# EAGLE design cpu_board (EAGLE 7.2.0)
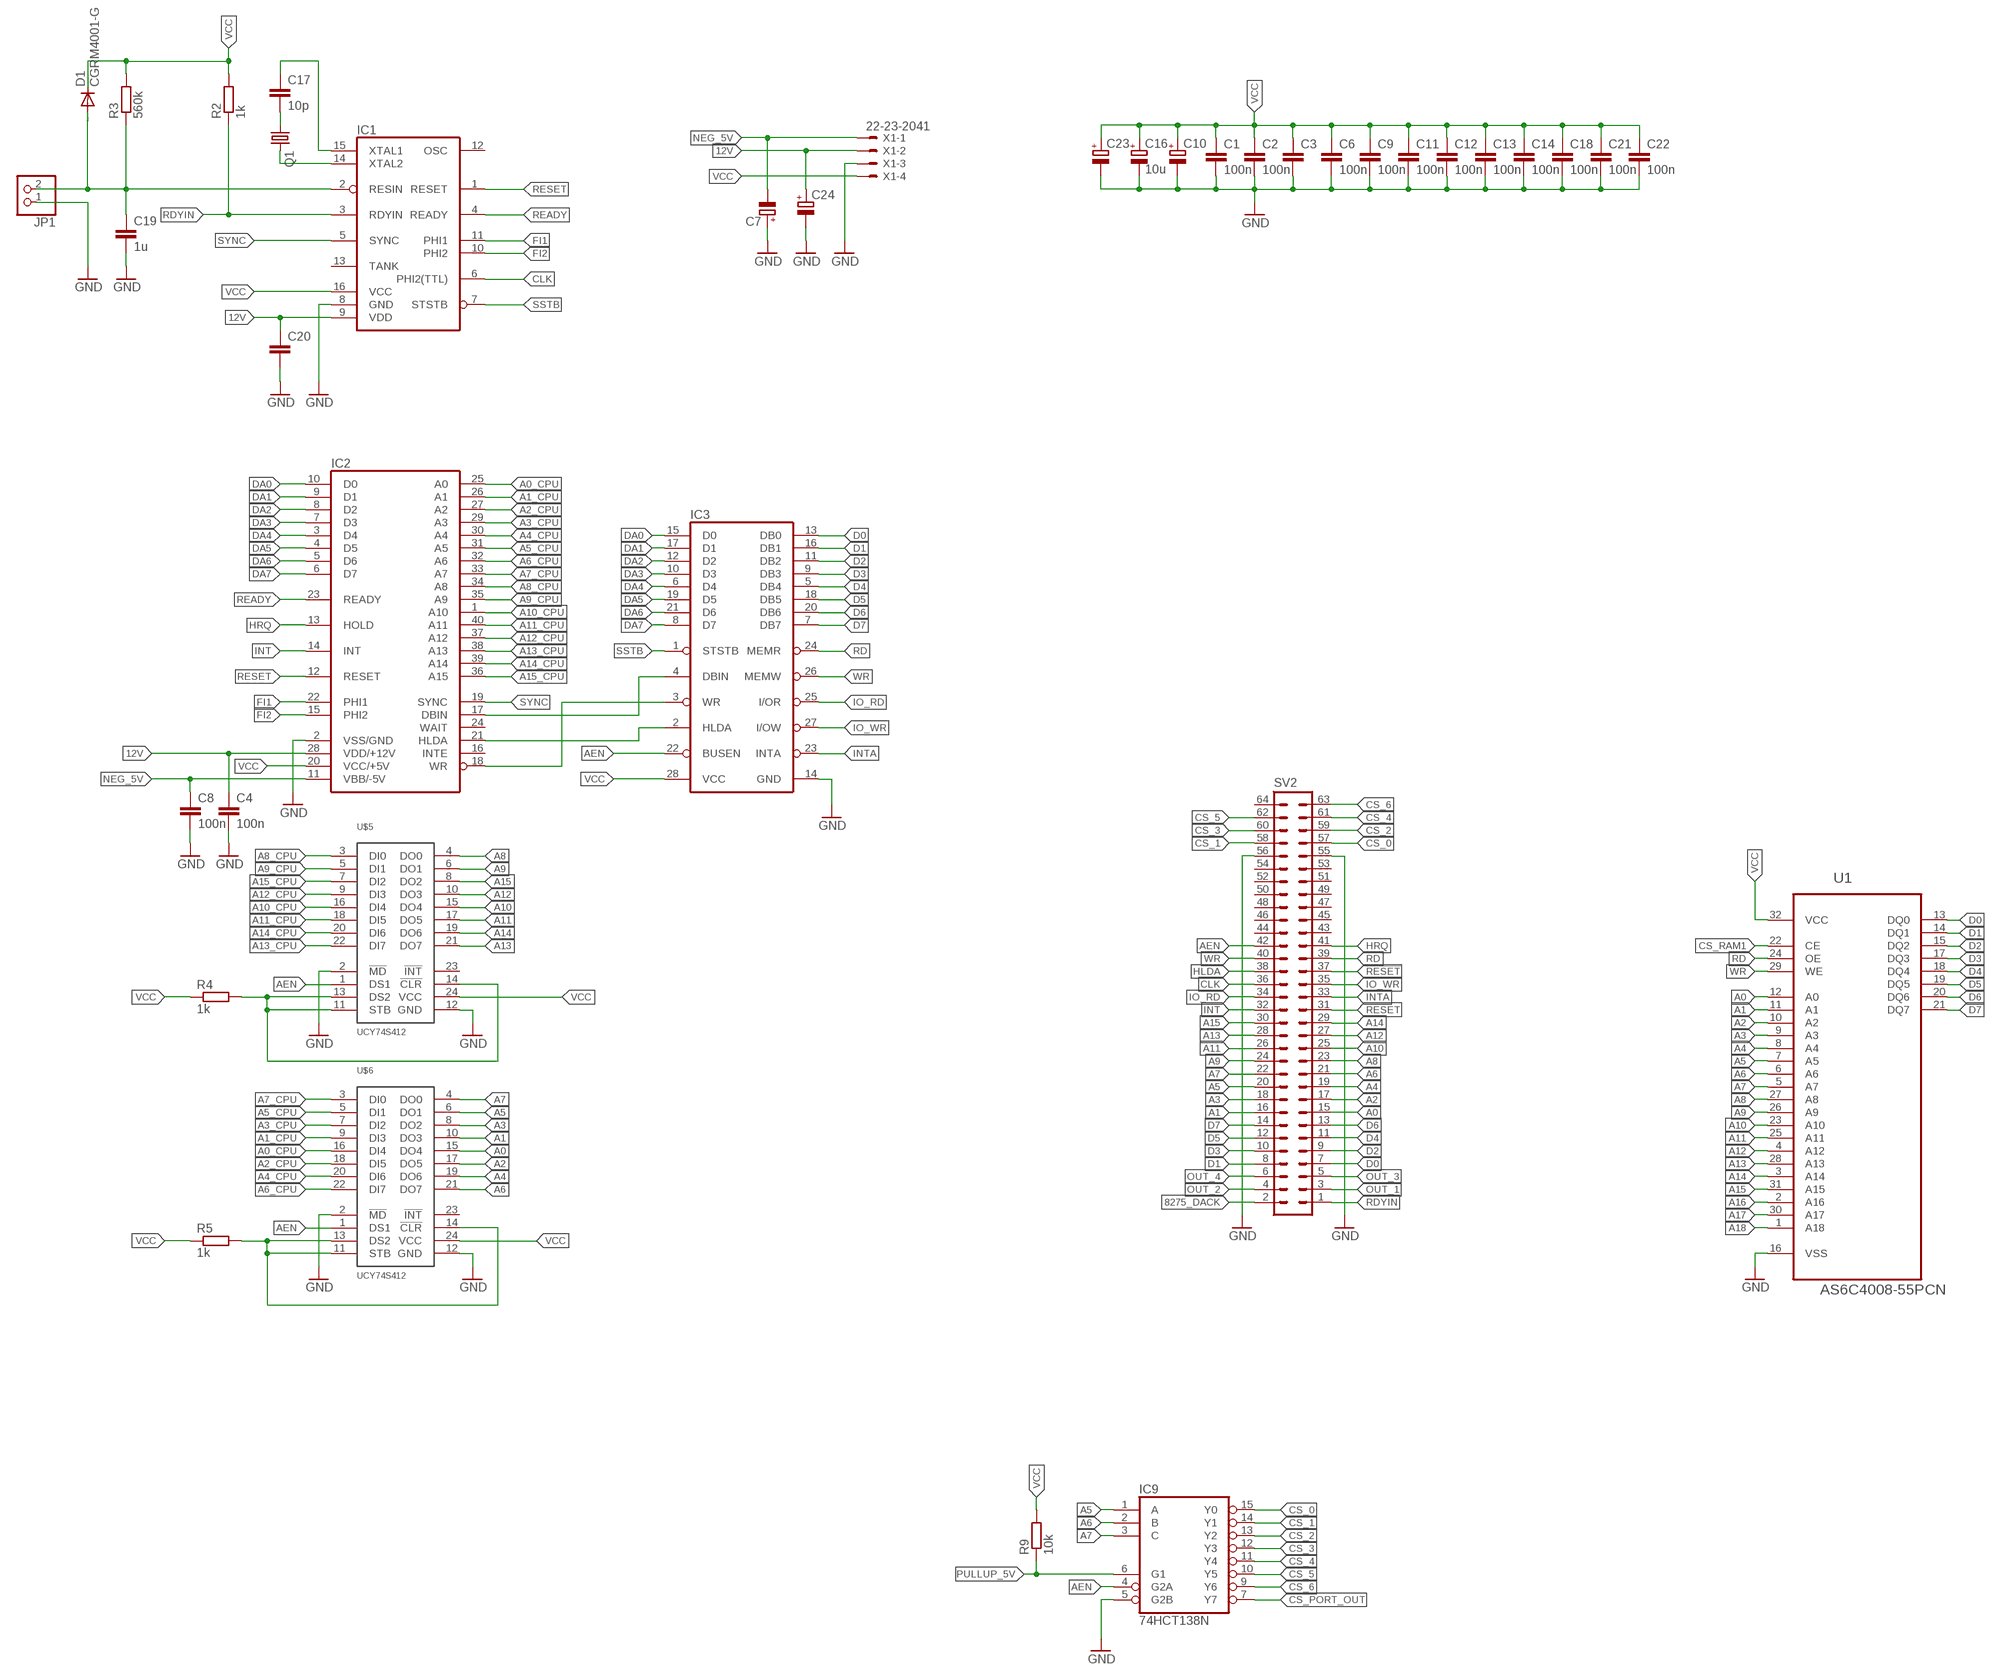
[diagram p0: schematic, sheet 1, part 1 of 2]
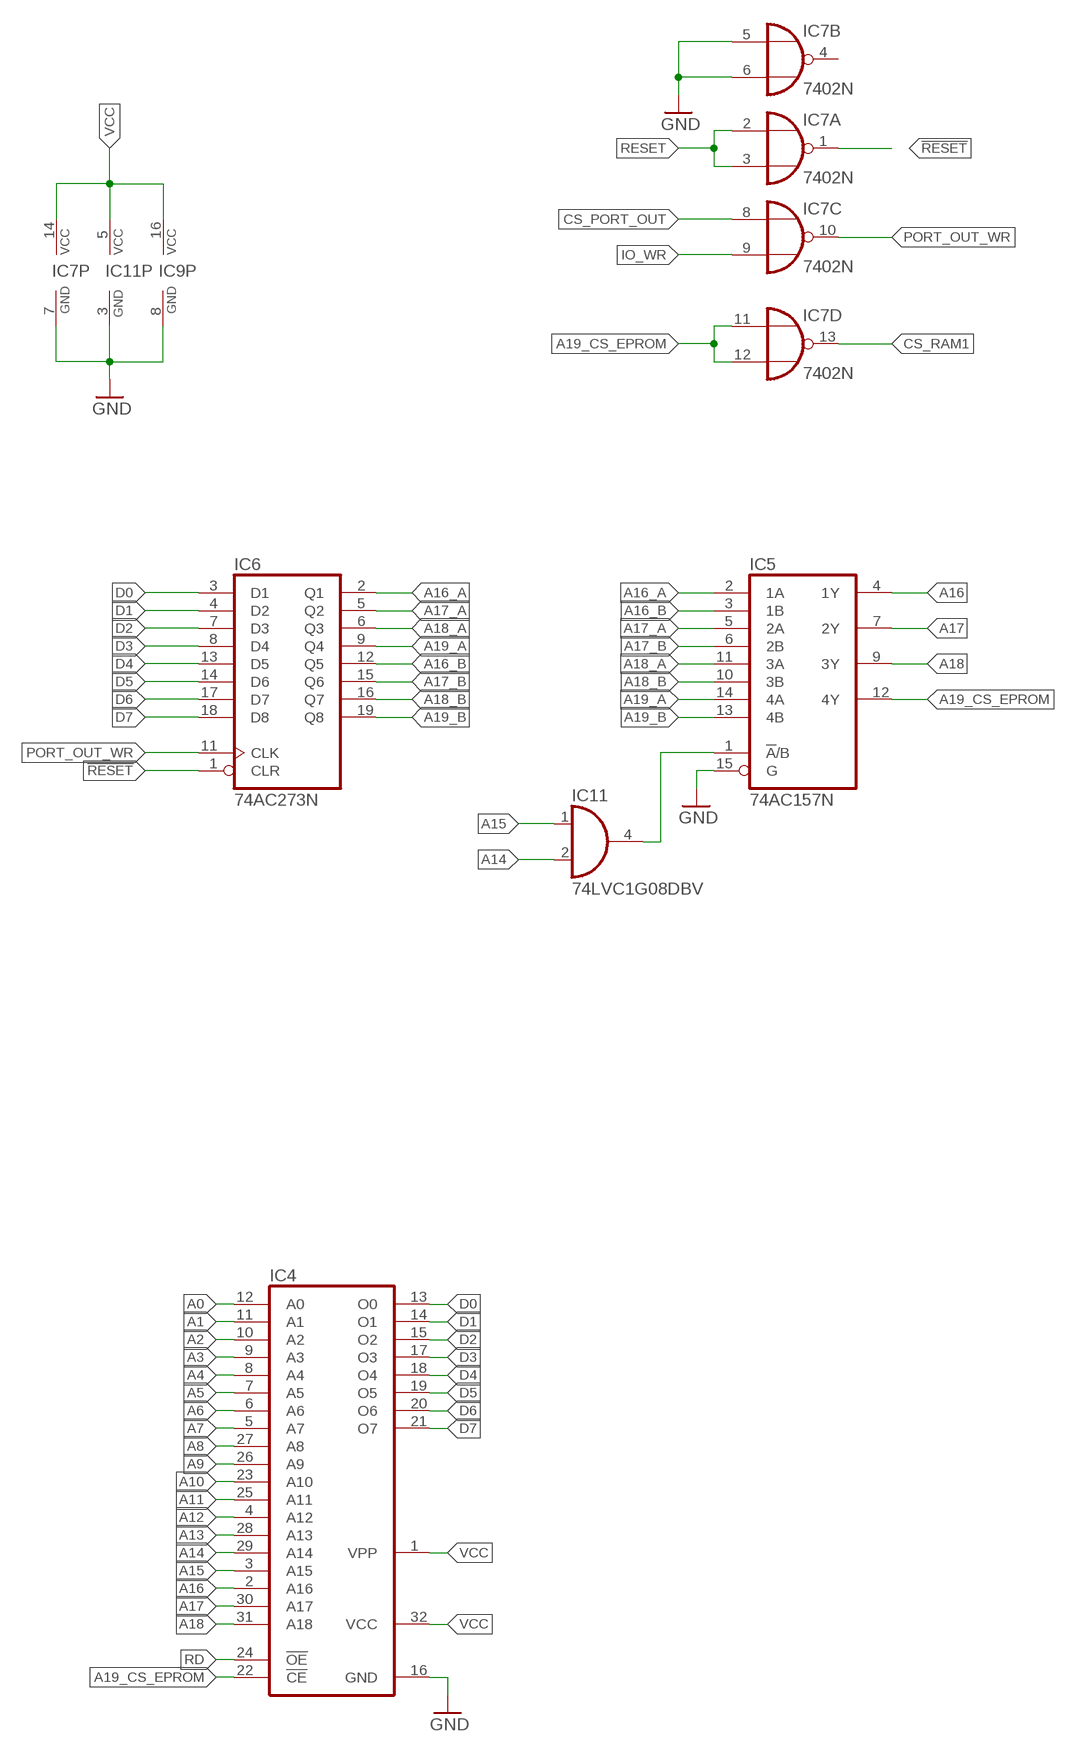
[diagram p1: schematic, sheet 1, part 2 of 2]

## Parts
C1  100n  C-EUC1206  [C1206]
C2  100n  C-EUC1206  [C1206]
C3  C-EUC0603  [C0603]
C4  100n  C-EUC1206  [C1206]
C6  100n  C-EUC1206  [C1206]
C7  CPOL-EUE2.5-7  [E2,5-7]
C8  100n  C-EUC1206  [C1206]
C9  100n  C-EUC0603  [C0603]
C10  CPOL-EUE3.5-8  [E3,5-8]
C11  100n  C-EUC0805  [C0805]
C12  100n  C-EUC0805  [C0805]
C13  100n  C-EUC0805  [C0805]
C14  100n  C-EUC0603  [C0603]
C16  10u  CPOL-EUSMCB  [SMC_B]
C17  10p  C-EUC0603  [C0603]
C18  100n  C-EUC0603  [C0603]
C19  1u  C-EUC0603  [C0603]
C20  C-EUC0603  [C0603]
C21  100n  C-EUC1206  [C1206]
C22  100n  C-EUC0603  [C0603]
C23  CPOL-EUE3.5-8  [E3,5-8]
C24  CPOL-EUE3.5-8  [E3,5-8]
D1  CGRM4001-G  [SOD-123_MINI-SMA]
IC1  8224  [DIL16]
IC2  8080  [DIL40]
IC3  8228  [DIL28-6]
IC4  27C4001D  [DIL32]
IC5  74AC157N  [DIL16]
IC6  74AC273N  [DIL20]
IC7  7402N  [DIL14]
IC9  74HCT138N  [DIL16]
IC11  74LVC1G08DBV  [SOT23-5]
JP1  PINHD-1X2  [1X02]
Q1  CRYSTALHC49U-V  [HC49U-V]
R2  1k  R-EU_R0603  [R0603]
R3  560k  R-EU_R0603  [R0603]
R4  1k  R-EU_R0603  [R0603]
R5  1k  R-EU_0204/7  [0204/7]
R9  10k  R-EU_R0603  [R0603]
SV2  ML64L  [ML64L]
U1  AS6C4008-55PCN  [DIP254P1524X393-32]
U$5  UCY74S412  [DIL24-6]
U$6  UCY74S412  [DIL24-6]
X1  22-23-2041  [22-23-2041]

## Nets
12V: C4.1 C20.1 C24.+ IC1.9(VDD) IC2.28(VDD/+12V) X1.2
8275_DACK: SV2.2
!RESET: IC6.1(CLR) IC7.1(A:O) SV2.37
A0: IC4.12(A0) SV2.15 U1.12(A0) U$6.15(DO4)
A0_CPU: IC2.25(A0) U$6.16(DI4)
A1: IC4.11(A1) SV2.16 U1.11(A1) U$6.10(DO3)
A1_CPU: IC2.26(A1) U$6.9(DI3)
A2: IC4.10(A2) SV2.17 U1.10(A2) U$6.17(DO5)
A2_CPU: IC2.27(A2) U$6.18(DI5)
A3: IC4.9(A3) SV2.18 U1.9(A3) U$6.8(DO2)
A3_CPU: IC2.29(A3) U$6.7(DI2)
A4: IC4.8(A4) SV2.19 U1.8(A4) U$6.19(DO6)
A4_CPU: IC2.30(A4) U$6.20(DI6)
A5: IC4.7(A5) IC9.1(A) SV2.20 U1.7(A5) U$6.6(DO1)
A5_CPU: IC2.31(A5) U$6.5(DI1)
A6: IC4.6(A6) IC9.2(B) SV2.21 U1.6(A6) U$6.21(DO7)
A6_CPU: IC2.32(A6) U$6.22(DI7)
A7: IC4.5(A7) IC9.3(C) SV2.22 U1.5(A7) U$6.4(DO0)
A7_CPU: IC2.33(A7) U$6.3(DI0)
A8: IC4.27(A8) SV2.23 U1.27(A8) U$5.4(DO0)
A8_CPU: IC2.34(A8) U$5.3(DI0)
A9: IC4.26(A9) SV2.24 U1.26(A9) U$5.6(DO1)
A9_CPU: IC2.35(A9) U$5.5(DI1)
A10: IC4.23(A10) SV2.25 U1.23(A10) U$5.15(DO4)
A10_CPU: IC2.1(A10) U$5.16(DI4)
A11: IC4.25(A11) SV2.26 U1.25(A11) U$5.17(DO5)
A11_CPU: IC2.40(A11) U$5.18(DI5)
A12: IC4.4(A12) SV2.27 U1.4(A12) U$5.10(DO3)
A12_CPU: IC2.37(A12) U$5.9(DI3)
A13: IC4.28(A13) SV2.28 U1.28(A13) U$5.21(DO7)
A13_CPU: IC2.38(A13) U$5.22(DI7)
A14: IC4.29(A14) IC11.2(I1) SV2.29 U1.3(A14) U$5.19(DO6)
A14_CPU: IC2.39(A14) U$5.20(DI6)
A15: IC4.3(A15) IC11.1(I0) SV2.30 U1.31(A15) U$5.8(DO2)
A15_CPU: IC2.36(A15) U$5.7(DI2)
A16: IC4.2(A16) IC5.4(1Y) U1.2(A16)
A16_A: IC5.2(1A) IC6.2(Q1)
A16_B: IC5.3(1B) IC6.12(Q5)
A17: IC4.30(A17) IC5.7(2Y) U1.30(A17)
A17_A: IC5.5(2A) IC6.5(Q2)
A17_B: IC5.6(2B) IC6.15(Q6)
A18: IC4.31(A18) IC5.9(3Y) U1.1(A18)
A18_A: IC5.11(3A) IC6.6(Q3)
A18_B: IC5.10(3B) IC6.16(Q7)
A19_A: IC5.14(4A) IC6.9(Q4)
A19_B: IC5.13(4B) IC6.19(Q8)
A19_CS_EPROM: IC4.22(!CE) IC5.12(4Y) IC7.11(D:I0) IC7.12(D:I1)
AEN: IC3.22(BUSEN) IC9.4(G2A) SV2.42 U$5.1(DS1) U$6.1(DS1)
CLK: IC1.6(PHI2(TTL)) SV2.36
CS_0: IC9.15(Y0) SV2.57
CS_1: IC9.14(Y1) SV2.58
CS_2: IC9.13(Y2) SV2.59
CS_3: IC9.12(Y3) SV2.60
CS_4: IC9.11(Y4) SV2.61
CS_5: IC9.10(Y5) SV2.62
CS_6: IC9.9(Y6) SV2.63
CS_PORT_OUT: IC7.8(C:I0) IC9.7(Y7)
CS_RAM1: IC7.13(D:O) U1.22(CE)
D0: IC3.13(DB0) IC4.13(O0) IC6.3(D1) SV2.7 U1.13(DQ0)
D1: IC3.16(DB1) IC4.14(O1) IC6.4(D2) SV2.8 U1.14(DQ1)
D2: IC3.11(DB2) IC4.15(O2) IC6.7(D3) SV2.9 U1.15(DQ2)
D3: IC3.9(DB3) IC4.17(O3) IC6.8(D4) SV2.10 U1.17(DQ3)
D4: IC3.5(DB4) IC4.18(O4) IC6.13(D5) SV2.11 U1.18(DQ4)
D5: IC3.18(DB5) IC4.19(O5) IC6.14(D6) SV2.12 U1.19(DQ5)
D6: IC3.20(DB6) IC4.20(O6) IC6.17(D7) SV2.13 U1.20(DQ6)
D7: IC3.7(DB7) IC4.21(O7) IC6.18(D8) SV2.14 U1.21(DQ7)
DA0: IC2.10(D0) IC3.15(D0)
DA1: IC2.9(D1) IC3.17(D1)
DA2: IC2.8(D2) IC3.12(D2)
DA3: IC2.7(D3) IC3.10(D3)
DA4: IC2.3(D4) IC3.6(D4)
DA5: IC2.4(D5) IC3.19(D5)
DA6: IC2.5(D6) IC3.21(D6)
DA7: IC2.6(D7) IC3.8(D7)
FI1: IC1.11(PHI1) IC2.22(PHI1)
FI2: IC1.10(PHI2) IC2.15(PHI2)
GND: C1.2 C2.2 C3.2 C4.2 C6.2 C7.+ C8.2 C9.2 C10.- C11.2 C12.2 C13.2 C14.2 C16.- C18.2 C19.2 C20.2 C21.2 C22.2 C23.- C24.- IC1.8(GND) IC2.2(VSS/GND) IC3.14(GND) IC4.16(GND) IC5.15(G) IC7.5(B:I0) IC7.6(B:I1) IC7.7(P:GND) IC9.5(G2B) IC9.8(GND) IC11.3(GND) JP1.1 SV2.55 SV2.56 U1.16(VSS) U$5.2(!MD) U$5.12(GND) U$6.2(!MD) U$6.12(GND) X1.3
HLDA: IC2.21(HLDA) IC3.2(HLDA) SV2.38
HRQ: IC2.13(HOLD) SV2.41
INT: IC2.14(INT) SV2.32
INTA: IC3.23(INTA) SV2.33
IO_RD: IC3.25(I/OR) SV2.34
IO_WR: IC3.27(I/OW) IC7.9(C:I1) SV2.35
N$1: IC2.17(DBIN) IC3.4(DBIN)
N$2: IC5.1(!A!/B) IC11.4(O)
N$5: IC2.18(WR) IC3.3(WR)
N$9: IC1.14(XTAL2) Q1.2
N$10: C17.2 Q1.1
N$11: C17.1 IC1.15(XTAL1)
N$12: C19.1 D1.A IC1.2(RESIN) JP1.2 R3.1
N$13: R5.2 U$6.11(STB) U$6.13(DS2) U$6.14(!CLR)
N$15: R4.2 U$5.11(STB) U$5.13(DS2) U$5.14(!CLR)
NEG_5V: C7.- C8.1 IC2.11(VBB/-5V) X1.1
OUT_1: SV2.3
OUT_2: SV2.4
OUT_3: SV2.5
OUT_4: SV2.6
PORT_OUT_WR: IC6.11(CLK) IC7.10(C:O)
PULLUP_5V: IC9.6(G1) R9.1
RD: IC3.24(MEMR) IC4.24(!OE) SV2.39 U1.24(OE)
RDYIN: IC1.3(RDYIN) R2.1 SV2.1
READY: IC1.4(READY) IC2.23(READY)
RESET: IC1.1(RESET) IC2.12(RESET) IC7.2(A:I0) IC7.3(A:I1) SV2.31
SSTB: IC1.7(STSTB) IC3.1(STSTB)
SYNC: IC1.5(SYNC) IC2.19(SYNC)
VCC: C1.1 C2.1 C3.1 C6.1 C9.1 C10.+ C11.1 C12.1 C13.1 C14.1 C16.+ C18.1 C21.1 C22.1 C23.+ D1.C IC1.16(VCC) IC2.20(VCC/+5V) IC3.28(VCC) IC4.1(VPP) IC4.32(VCC) IC7.14(P:VCC) IC9.16(VCC) IC11.5(VCC) R2.2 R3.2 R4.1 R5.1 R9.2 U1.32(VCC) U$5.24(VCC) U$6.24(VCC) X1.4
WR: IC3.26(MEMW) SV2.40 U1.29(WE)
Unconnected: IC1.12(OSC) IC1.13(TANK) IC2.16(INTE) IC2.24(WAIT) IC7.4(B:O) SV2.43 SV2.44 SV2.45 SV2.46 SV2.47 SV2.48 SV2.49 SV2.50 SV2.51 SV2.52 SV2.53 SV2.54 SV2.64 U$5.23(!INT) U$6.23(!INT)

## Power pins joined to a net without a drawn wire
GND: IC5.8(GND) IC6.10(GND)
VCC: IC5.16(VCC) IC6.20(VCC)

## Library data of the parts
C1-C4 C6 C8 C9 C11-C14 C17-C22 = rcl:C-EU: CAPACITOR, European symbol
C7 C10 C16 C23 C24 = rcl:CPOL-EU: POLARIZED CAPACITOR, European symbol
D1 = diode:CGRM400*-G: Molded plasitc,JEDEC SOD-123/Mini SMA Source: Comchip CGRM4001-G.pdf
IC1 = micro-intel:8224: MICROCOMPUTER/PERIPHERAL DEVICE; OC_FARNELL: unknown; OC_NEWARK: unknown
IC2 = micro-intel:8080: MICROCOMPUTER/PERIPHERAL DEVICE; OC_FARNELL: unknown; OC_NEWARK: unknown
IC3 = micro-intel:8228: MICROCOMPUTER/PERIPHERAL DEVICE; OC_FARNELL: unknown; OC_NEWARK: unknown
IC4 = memory-nec:27C4001D: MEMORY; MPN: M27C4001-12B1; OC_FARNELL: 3338137; OC_NEWARK: 37M4736
IC5 = 74xx-eu:74*157: Quadruple 2-line to 1-line data SELECTOR/MULTIPLEXER
IC6 = 74xx-eu:74*273: Octal D type FLIP FLOP, clear
IC7 = 74xx-eu:74*02: Quad 2-input NOR gate
IC9 = 74xx-eu:74*138: 3-line to 8-line DECODER/DEMULTIPLEXER
IC11 = 74xx-little-de:74*1G08: 2-input AND gate
JP1 = pinhead:PINHD-1X2: PIN HEADER
Q1 = crystal:CRYSTAL: CRYSTAL; OC_FARNELL: 1666969; OC_NEWARK: unknown
R2-R5 R9 = rcl:R-EU_: RESISTOR, European symbol
SV2 = con-harting-ml:ML64: HARTING; OC_FARNELL: unknown; OC_NEWARK: unknown
U1 = Alliance_Memory_By_element14_Batch_1:AS6C4008-55PCN: CMOS SRAM; MPN: AS6C4008-55PCN; OC_FARNELL: 1562900; OC_NEWARK: 94M6217; PACKAGE: DIP-32; SUPPLIER: ALLIANCE MEMORY
U$5 U$6 = mw:UCY74S412
X1 = con-molex:22-23-2041: .100" (2.54mm) Center Header - 4 Pin; MF: MOLEX; MPN: 22-23-2041; OC_FARNELL: 1462920; OC_NEWARK: 38C0355

## Board
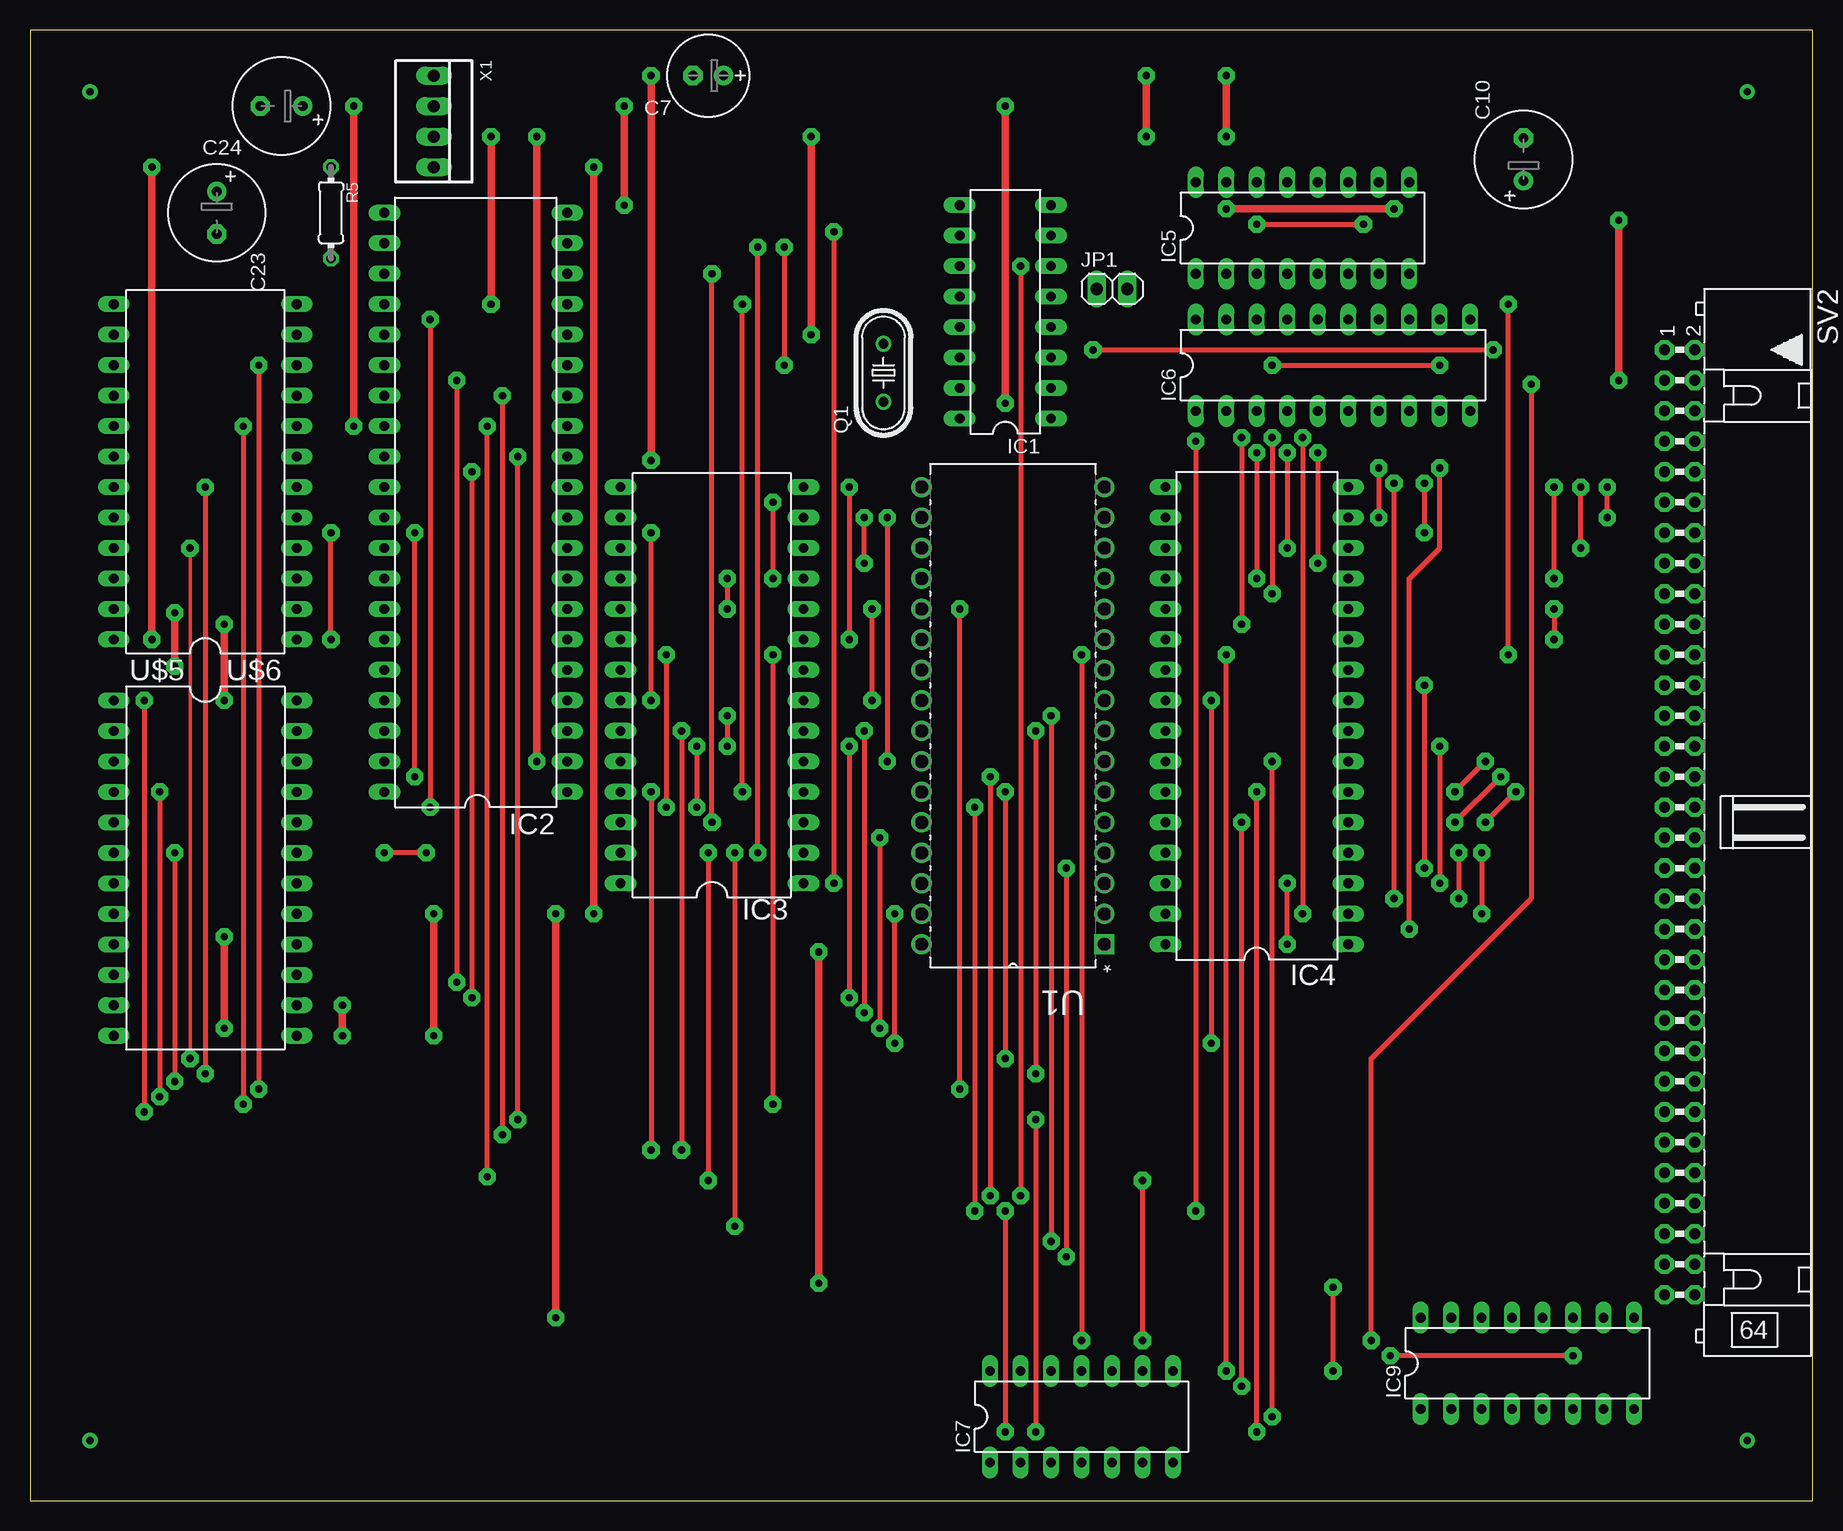
[diagram p2: board, top side]
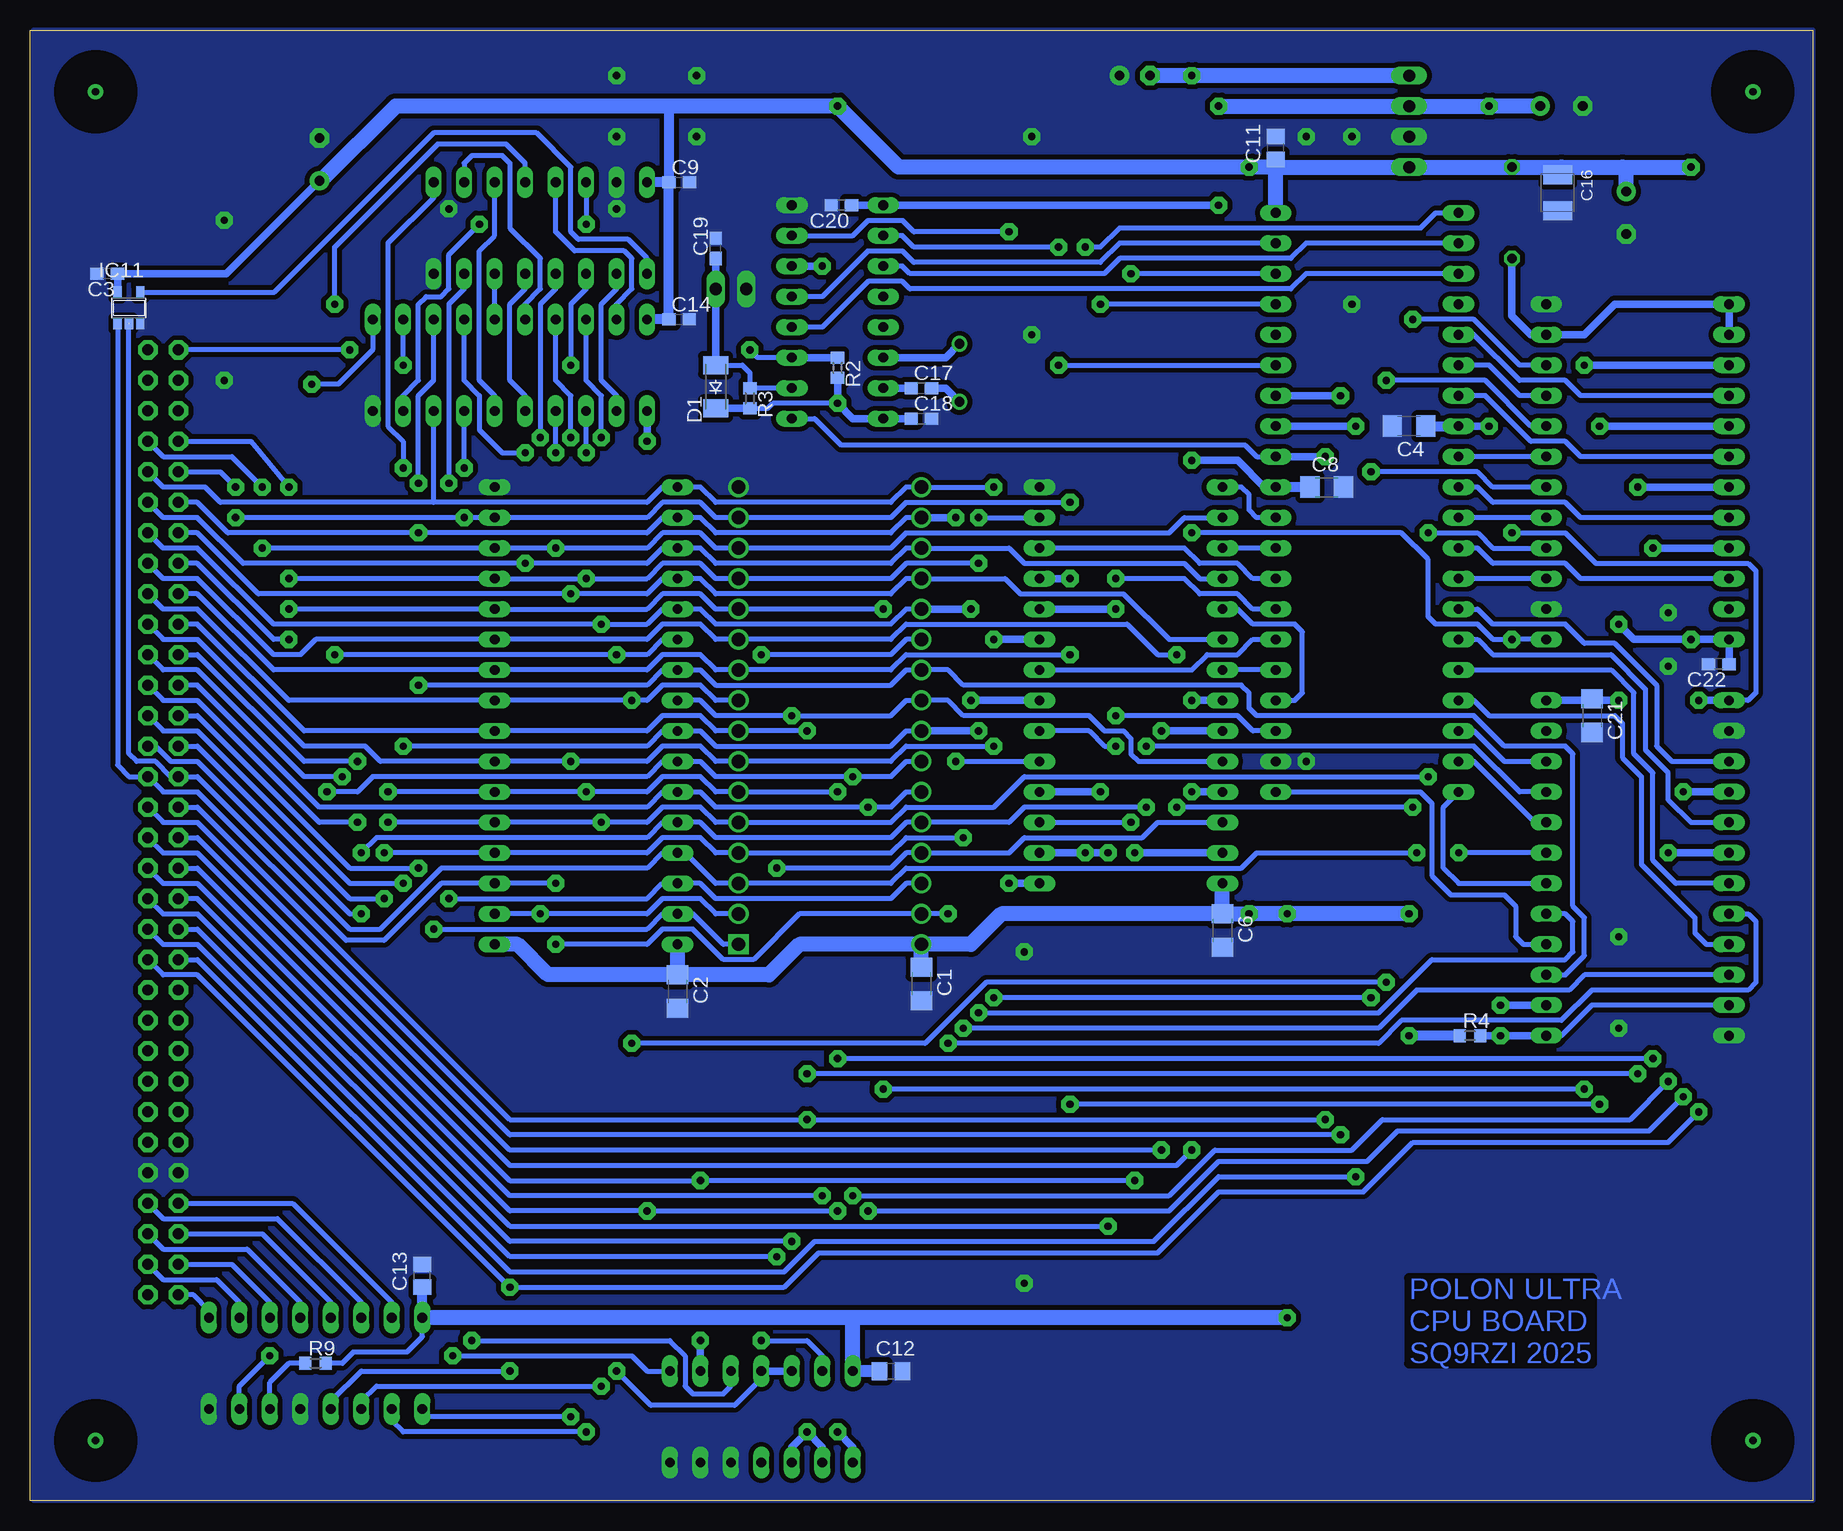
[diagram p3: board, bottom side, seen from below]

Size 148.58 x 122.55 mm. Coordinates in mm from the lower left corner, seen from the top.
Outline: 0,0 148.58,0 148.58,122.55 0,122.55 0,0
Copper layers (1*16): Top 0.035mm / dielectric 1.5mm / Bottom 0.035mm
Design rules "default *": minimum track width 10mil, minimum drill 24mil, track to track 8mil, track to pad 8mil, pad to pad 8mil, via to via 8mil, smd to smd 8mil, copper to edge 0mil, drill to drill 8mil, minimum pad ring 10mil, minimum via ring 8mil, stop-mask expansion 4mil, vias tented up to drill 0mil, thermal gap 10mil
bRestrict: area 2,2 to 8,8; area 2,114.3 to 8,120.4; area 140.1,2 to 146.2,8; area 140.1,114.3 to 146.2,120.4

### Footprints (pad centres in the part's own frame; a part is rotated, then mirrored left to right if it is on the bottom)
C1206 = smd 1.6 x 1.8: 1 -1.4,0; 2 1.4,0
C0603 = smd 1.1 x 1: 1 -0.85,0; 2 0.85,0
E2,5-7 = drill 0.813 pad 1.6: + -1.27,0 | drill 0.813 pad 1.6 octagon: - 1.27,0
E3,5-8 = drill 0.813 pad 1.6: + -1.778,0 | drill 0.813 pad 1.6 octagon: - 1.778,0
C0805 = smd 1.3 x 1.5: 1 -0.95,0; 2 0.95,0
SMC_B = smd 1.6 x 2.4: + -1.5,0; - 1.5,0
SOD-123_MINI-SMA = smd 1.5 x 2.1: A 1.8,0; C -1.8,0
DIL16 = drill 0.813 long: 1 -8.89,-3.81; 2 -6.35,-3.81; 3 -3.81,-3.81; 4 -1.27,-3.81; 5 1.27,-3.81; 6 3.81,-3.81; 7 6.35,-3.81; 8 8.89,-3.81; 9 8.89,3.81; 10 6.35,3.81; 11 3.81,3.81; 12 1.27,3.81; 13 -1.27,3.81; 14 -3.81,3.81; 15 -6.35,3.81; 16 -8.89,3.81
DIL40 = drill 0.813 long: 1 -24.13,-7.62; 2 -21.59,-7.62; 3 -19.05,-7.62; 4 -16.51,-7.62; 5 -13.97,-7.62; 6 -11.43,-7.62; 7 -8.89,-7.62; 8 -6.35,-7.62; 9 -3.81,-7.62; 10 -1.27,-7.62; 11 1.27,-7.62; 12 3.81,-7.62; 13 6.35,-7.62; 14 8.89,-7.62; 15 11.43,-7.62; 16 13.97,-7.62; 17 16.51,-7.62; 18 19.05,-7.62; 19 21.59,-7.62; 20 24.13,-7.62; 21 24.13,7.62; 22 21.59,7.62; 23 19.05,7.62; 24 16.51,7.62; 25 13.97,7.62; 26 11.43,7.62; 27 8.89,7.62; 28 6.35,7.62; 29 3.81,7.62; 30 1.27,7.62; 31 -1.27,7.62; 32 -3.81,7.62; 33 -6.35,7.62; 34 -8.89,7.62; 35 -11.43,7.62; 36 -13.97,7.62; 37 -16.51,7.62; 38 -19.05,7.62; 39 -21.59,7.62; 40 -24.13,7.62
DIL28-6 = drill 0.813 long: 1 -16.51,-7.62; 2 -13.97,-7.62; 3 -11.43,-7.62; 4 -8.89,-7.62; 5 -6.35,-7.62; 6 -3.81,-7.62; 7 -1.27,-7.62; 8 1.27,-7.62; 9 3.81,-7.62; 10 6.35,-7.62; 11 8.89,-7.62; 12 11.43,-7.62; 13 13.97,-7.62; 14 16.51,-7.62; 15 16.51,7.62; 16 13.97,7.62; 17 11.43,7.62; 18 8.89,7.62; 19 6.35,7.62; 20 3.81,7.62; 21 1.27,7.62; 22 -1.27,7.62; 23 -3.81,7.62; 24 -6.35,7.62; 25 -8.89,7.62; 26 -11.43,7.62; 27 -13.97,7.62; 28 -16.51,7.62
DIL32 = drill 0.813 long: 1 -19.05,-7.62; 2 -16.51,-7.62; 3 -13.97,-7.62; 4 -11.43,-7.62; 5 -8.89,-7.62; 6 -6.35,-7.62; 7 -3.81,-7.62; 8 -1.27,-7.62; 9 1.27,-7.62; 10 3.81,-7.62; 11 6.35,-7.62; 12 8.89,-7.62; 13 11.43,-7.62; 14 13.97,-7.62; 15 16.51,-7.62; 16 19.05,-7.62; 17 19.05,7.62; 18 16.51,7.62; 19 13.97,7.62; 20 11.43,7.62; 21 8.89,7.62; 22 6.35,7.62; 23 3.81,7.62; 24 1.27,7.62; 25 -1.27,7.62; 26 -3.81,7.62; 27 -6.35,7.62; 28 -8.89,7.62; 29 -11.43,7.62; 30 -13.97,7.62; 31 -16.51,7.62; 32 -19.05,7.62
DIL20 = drill 0.813 long: 1 -11.43,-3.81; 2 -8.89,-3.81; 3 -6.35,-3.81; 4 -3.81,-3.81; 5 -1.27,-3.81; 6 1.27,-3.81; 7 3.81,-3.81; 8 6.35,-3.81; 9 8.89,-3.81; 10 11.43,-3.81; 11 11.43,3.81; 12 8.89,3.81; 13 6.35,3.81; 14 3.81,3.81; 15 1.27,3.81; 16 -1.27,3.81; 17 -3.81,3.81; 18 -6.35,3.81; 19 -8.89,3.81; 20 -11.43,3.81
DIL14 = drill 0.813 long: 1 -7.62,-3.81; 2 -5.08,-3.81; 3 -2.54,-3.81; 4 0,-3.81; 5 2.54,-3.81; 6 5.08,-3.81; 7 7.62,-3.81; 8 7.62,3.81; 9 5.08,3.81; 10 2.54,3.81; 11 0,3.81; 12 -2.54,3.81; 13 -5.08,3.81; 14 -7.62,3.81
SOT23-5 = smd 0.69 x 0.99: 1 -0.95,-1.29; 2 0,-1.29; 3 0.95,-1.29; 4 0.95,1.3; 5 -0.95,1.3
1X02 = drill 1.016 long: 1 -1.27,0; 2 1.27,0
HC49U-V = drill 0.813: 1 -2.413,0; 2 2.413,0
R0603 = smd 1 x 1.1: 1 -0.85,0; 2 0.85,0
0204/7 = drill 0.813 octagon: 1 -3.81,0; 2 3.81,0
ML64L = drill 0.914 pad 1.6 octagon: 1 -39.37,-1.27; 2 -39.37,1.27; 3 -36.83,-1.27; 4 -36.83,1.27; 5 -34.29,-1.27; 6 -34.29,1.27; 7 -31.75,-1.27; 8 -31.75,1.27; 9 -29.21,-1.27; 10 -29.21,1.27; 11 -26.67,-1.27; 12 -26.67,1.27; 13 -24.13,-1.27; 14 -24.13,1.27; 15 -21.59,-1.27; 16 -21.59,1.27; 17 -19.05,-1.27; 18 -19.05,1.27; 19 -16.51,-1.27; 20 -16.51,1.27; 21 -13.97,-1.27; 22 -13.97,1.27; 23 -11.43,-1.27; 24 -11.43,1.27; 25 -8.89,-1.27; 26 -8.89,1.27; 27 -6.35,-1.27; 28 -6.35,1.27; 29 -3.81,-1.27; 30 -3.81,1.27; 31 -1.27,-1.27; 32 -1.27,1.27; 33 1.27,-1.27; 34 1.27,1.27; 35 3.81,-1.27; 36 3.81,1.27; 37 6.35,-1.27; 38 6.35,1.27; 39 8.89,-1.27; 40 8.89,1.27; 41 11.43,-1.27; 42 11.43,1.27; 43 13.97,-1.27; 44 13.97,1.27; 45 16.51,-1.27; 46 16.51,1.27; 47 19.05,-1.27; 48 19.05,1.27; 49 21.59,-1.27; 50 21.59,1.27; 51 24.13,-1.27; 52 24.13,1.27; 53 26.67,-1.27; 54 26.67,1.27; 55 29.21,-1.27; 56 29.21,1.27; 57 31.75,-1.27; 58 31.75,1.27; 59 34.29,-1.27; 60 34.29,1.27; 61 36.83,-1.27; 62 36.83,1.27; 63 39.37,-1.27; 64 39.37,1.27
DIP254P1524X393-32 = drill 1.118 square: 1 -15.24,38.1 | drill 1.118: 2 -15.24,35.56; 3 -15.24,33.02; 4 -15.24,30.48; 5 -15.24,27.94; 6 -15.24,25.4; 7 -15.24,22.86; 8 -15.24,20.32; 9 -15.24,17.78; 10 -15.24,15.24; 11 -15.24,12.7; 12 -15.24,10.16; 13 -15.24,7.62; 14 -15.24,5.08; 15 -15.24,2.54; 16 -15.24,0; 17 0,0; 18 0,2.54; 19 0,5.08; 20 0,7.62; 21 0,10.16; 22 0,12.7; 23 0,15.24; 24 0,17.78; 25 0,20.32; 26 0,22.86; 27 0,25.4; 28 0,27.94; 29 0,30.48; 30 0,33.02; 31 0,35.56; 32 0,38.1
DIL24-6 = drill 0.813 long: 1 -13.97,-7.62; 2 -11.43,-7.62; 3 -8.89,-7.62; 4 -6.35,-7.62; 5 -3.81,-7.62; 6 -1.27,-7.62; 7 1.27,-7.62; 8 3.81,-7.62; 9 6.35,-7.62; 10 8.89,-7.62; 11 11.43,-7.62; 12 13.97,-7.62; 13 13.97,7.62; 14 11.43,7.62; 15 8.89,7.62; 16 6.35,7.62; 17 3.81,7.62; 18 1.27,7.62; 19 -1.27,7.62; 20 -3.81,7.62; 21 -6.35,7.62; 22 -8.89,7.62; 23 -11.43,7.62; 24 -13.97,7.62
22-23-2041 = drill 1 long: 1 -3.81,0; 2 -1.27,0; 3 1.27,0; 4 3.81,0

### Placement (x,y rotation side)
C1  74.3,43.05 270 bottom
C2  94.61,42.42 270 bottom
C3  142.14,102.23 180 bottom
C4  33.66,89.53 180 bottom
C6  49.21,47.5 270 bottom
C7  56.52,118.75 180 top
C8  40.51,84.45 0 bottom
C9  94.48,109.86 0 bottom
C10  124.46,111.76 90 top
C11  44.77,112.71 90 bottom
C12  76.83,10.79 0 bottom
C13  115.89,18.73 90 bottom
C14  94.49,98.42 0 bottom
C16  21.27,108.99 270 bottom
C17  74.3,92.71 0 bottom
C18  74.3,90.17 0 bottom
C19  91.44,104.35 90 bottom
C20  80.96,107.95 180 bottom
C21  18.41,65.41 270 bottom
C22  7.85,69.71 180 bottom
C23  15.56,107.31 270 top
C24  20.95,116.2 180 top
D1  91.44,92.81 90 bottom
IC1  81.28,99.06 90 top
IC2  37.15,83.19 90 top
IC3  56.83,67.94 90 top
IC4  102.23,65.41 90 top
IC5  106.05,106.05 0 top
IC6  108.58,94.61 0 top
IC7  87.63,6.99 0 top
IC9  124.78,11.43 0 top
IC11  140.34,99.38 0 bottom
JP1  90.17,100.97 0 top
Q1  71.12,93.98 90 top
R2  81.28,94.4 270 bottom
R3  88.58,91.86 270 bottom
R4  28.57,38.73 0 bottom
R5  25.08,107.31 270 top
R9  124.78,11.43 0 bottom
SV2  137.48,56.52 270 top
U1  74.3,84.45 180 top
U$5  14.61,52.7 270 top
U$6  14.61,85.72 90 top
X1  33.66,114.94 270 top

### Tracks (layer width: path | path; a pad name or v marks a point on that pad's centre or on a via)
12V  (via drill 0.6 pad 1.42)
  Top 0.61: v26.99,89.53 v26.99,116.2 | v49.53,107.95 v49.53,116.2
  Bottom 0.61: IC2.28 v26.99,89.53 | C20.1 IC1.9 v49.53,107.95
  Bottom 0.813: C4.1 IC2.28
  Bottom 1.27: C24.+ v26.99,116.2 X1.2 v49.53,116.2
!RESET  (via drill 0.6 pad 1.42)
  Top 0.406: v97.16,88.27 v97.16,24.13 | v81.28,24.13 v81.28,5.71
  Bottom 0.406: SV2.37 134.62,50.16 108.58,24.13 v97.16,24.13 v81.28,24.13
  Bottom 0.61: IC6.1 v97.16,88.27 | IC7.1 80.01,4.45 v81.28,5.71
A0  (via drill 0.6 pad 1.42)
  Top 0.406: v127,74.3 v127,71.75 | v19.05,94.61 v19.05,34.29 | v77.47,34.29 v77.47,74.3
  Bottom 0.406: SV2.15 134.62,78.11 128.27,71.75 v127,71.75 | v77.47,74.3 U1.12 91.44,74.3 92.71,75.56 95.89,75.56 97.16,74.3 IC4.12 v127,74.3 | v19.05,34.29 v77.47,34.29
  Bottom 0.61: U$6.15 v19.05,94.61
A0_CPU
  Bottom 0.406: U$6.16 19.37,92.08 20.64,93.34 24.45,93.34 28.26,97.16 IC2.25
A1  (via drill 0.6 pad 1.42)
  Top 0.406: v33.34,98.42 v33.34,57.78 | v53.02,70.48 v53.02,57.78
  Bottom 0.406: SV2.16 137.48,76.83 134.62,76.83 128.27,70.48 126.05,70.48 124.78,71.75 IC4.11 97.16,71.75 95.89,73.03 92.71,73.03 91.44,71.75 U1.11 76.83,71.75 75.56,73.03 57.15,73.03 54.61,70.48 v53.02,70.48 | U$6.10 24.45,94.61 28.26,98.42 v33.34,98.42 | v33.34,57.78 v53.02,57.78
A1_CPU
  Bottom 0.406: U$6.9 24.45,92.08 26.99,94.61 IC2.26
A2  (via drill 0.6 pad 1.42)
  Top 0.406: v17.78,89.53 v17.78,33.02 | v61.91,70.48 v61.91,33.02
  Bottom 0.406: SV2.17 134.62,75.56 128.27,69.22 IC4.10 97.16,69.22 95.89,70.48 92.71,70.48 91.44,69.22 U1.10 76.83,69.22 75.56,70.48 v61.91,70.48 | v17.78,33.02 v61.91,33.02
  Bottom 0.61: U$6.17 v17.78,89.53
A2_CPU
  Bottom 0.406: U$6.18 19.37,87 20.64,88.27 23.5,88.27 27.3,92.08 IC2.27
A3  (via drill 0.6 pad 1.42)
  Top 0.406: v35.56,93.34 v35.56,43.18 | v98.42,66.67 v98.42,38.1
  Bottom 0.406: U1.9 91.44,66.67 92.71,67.94 95.89,67.94 97.16,66.67 v98.42,66.67 IC4.9 127,66.67 134.62,74.3 137.48,74.3 SV2.18 | U$6.8 23.5,89.53 27.3,93.34 v35.56,93.34 | v35.56,43.18 68.9,43.18 73.98,38.1 v98.42,38.1
A3_CPU
  Bottom 0.406: U$6.7 IC2.29
A4  (via drill 0.6 pad 1.42)
  Top 0.406: v14.61,84.45 v14.61,35.56 | v83.82,64.14 v83.82,35.56
  Bottom 0.406: v83.82,64.14 U1.8 91.44,64.14 92.71,65.41 95.89,65.41 97.16,64.14 IC4.8 125.73,64.14 134.62,73.03 SV2.19 | v14.61,35.56 v83.82,35.56
  Bottom 0.61: U$6.19 v14.61,84.45
A4_CPU
  Bottom 0.406: U$6.20 19.37,81.92 20.64,83.19 26.67,83.19 27.94,84.45 IC2.30
A5  (via drill 0.6 pad 1.42)
  Top 0.406: v103.5,6.99 v103.5,61.59 | v36.83,85.72 v36.83,41.91 | v68.26,62.87 v68.26,41.91
  Bottom 0.406: SV2.20 137.48,71.75 134.62,71.75 125.73,62.87 120.65,62.87 119.38,61.59 v103.5,61.59 | U$6.6 26.67,84.45 27.94,85.72 v36.83,85.72 | v68.26,62.87 75.56,62.87 76.83,61.59 U1.7 91.44,61.59 92.71,62.87 95.89,62.87 97.16,61.59 v103.5,61.59 | v36.83,41.91 v68.26,41.91 | v103.5,61.59 IC4.7 | v103.5,6.99 115.89,6.99 IC9.1
A5_CPU
  Bottom 0.406: U$6.5 IC2.31
A6  (via drill 0.6 pad 1.42)
  Top 0.305: v13.34,79.38 v13.34,36.83
  Top 0.406: v118.75,59.05 v121.28,61.59 | v102.23,5.71 v102.23,59.05 | v81.28,59.05 v81.28,36.83
  Bottom 0.406: v81.28,59.05 U1.6 91.44,59.05 92.71,60.33 95.89,60.33 97.16,59.05 v102.23,59.05 IC4.6 v118.75,59.05 | SV2.21 134.62,70.48 125.73,61.59 v121.28,61.59 | v13.34,36.83 v81.28,36.83 | IC9.2 118.43,6.67 117.47,5.71 v102.23,5.71
  Bottom 0.61: U$6.21 v13.34,79.38
A6_CPU
  Bottom 0.406: U$6.22 19.37,76.83 20.64,78.11 26.67,78.11 27.94,79.38 IC2.32
A7  (via drill 0.6 pad 1.42)
  Top 0.406: v118.75,56.52 v122.56,60.33 | v100.97,9.53 v100.97,56.52 | v32.07,60.33 v32.07,80.64
  Bottom 0.406: SV2.22 137.48,69.22 134.62,69.22 125.73,60.33 v122.56,60.33 | v32.07,60.33 65.72,60.33 68.26,57.78 75.56,57.78 76.83,56.52 U1.5 91.44,56.52 92.71,57.78 95.89,57.78 97.16,56.52 v100.97,56.52 | v32.07,80.64 27.94,80.64 26.67,79.38 U$6.4 | IC9.3 120.97,8.26 119.7,9.53 v100.97,9.53 | v100.97,56.52 IC4.5 | v100.97,56.52 v118.75,56.52
A7_CPU
  Bottom 0.406: U$6.3 IC2.33
A8  (via drill 0.6 pad 1.42)
  Top 0.406: v10.79,59.05 v10.79,33.66 | v78.74,57.78 v78.74,24.13
  Bottom 0.406: U1.27 75.56,59.05 76.83,57.78 v78.74,57.78 91.44,57.78 92.71,59.05 IC4.27 95.89,59.05 97.16,57.78 124.46,57.78 134.62,67.94 SV2.23 | v78.74,24.13 53.66,24.13 49.53,28.26 37.15,28.26 34.61,30.8 13.65,30.8 v10.79,33.66
  Bottom 0.61: U$5.4 v10.79,59.05
A8_CPU
  Bottom 0.406: IC2.34 27.94,74.3 26.67,73.03 20.64,73.03 19.05,71.44 16.51,71.44 13.02,67.94 13.02,62.87 11.75,61.59 U$5.3
A9  (via drill 0.6 pad 1.42)
  Top 0.406: v123.83,59.05 v121.28,56.52 | v12.06,53.98 v12.06,34.92 | v80.01,60.33 v80.01,25.4
  Bottom 0.406: U1.26 75.56,61.59 76.83,60.33 v80.01,60.33 91.44,60.33 92.71,61.59 IC4.26 95.89,61.59 97.16,60.33 120.02,60.33 121.28,59.05 v123.83,59.05 | SV2.24 137.48,66.67 134.62,66.67 124.46,56.52 v121.28,56.52 | v80.01,25.4 53.66,25.4 49.85,29.21 38.42,29.21 35.88,31.75 15.24,31.75 v12.06,34.92
  Bottom 0.61: U$5.6 v12.06,53.98
A9_CPU
  Bottom 0.406: IC2.35 27.94,71.75 26.67,70.48 16.83,70.48 13.97,67.63 13.97,62.55 12.06,60.64 12.06,58.42 10.16,56.52 U$5.5
A10  (via drill 0.6 pad 1.42)
  Top 0.406: v116.2,67.94 v116.2,52.7
  Bottom 0.406: v116.2,67.94 97.16,67.94 95.89,69.22 IC4.23 92.71,69.22 91.44,67.94 76.83,67.94 75.56,69.22 U1.23 72.07,69.22 70.8,67.94 47.62,67.94 46.99,67.31 46.99,66.04 46.35,65.41 28.26,65.41 25.72,62.87 20.64,62.87 20,62.23 20,49.53 19.05,48.58 19.05,45.4 20.64,43.81 U$5.15 | v116.2,52.7 121.92,52.7 134.62,65.41 SV2.25
A10_CPU
  Bottom 0.406: IC2.1 32.7,59.05 31.75,58.1 31.75,52.07 30.16,50.48 25.72,50.48 24.77,49.53 24.77,46.99 24.13,46.35 U$5.16
A11  (via drill 0.6 pad 1.42)
  Top 0.406: v117.47,62.87 v117.47,51.44 | v69.53,64.14 v69.53,40.64
  Bottom 0.406: U1.25 75.56,64.14 76.83,62.87 91.44,62.87 92.71,64.14 IC4.25 95.89,64.14 97.16,62.87 v117.47,62.87 | SV2.26 137.48,64.14 134.62,64.14 121.92,51.44 v117.47,51.44 | U$5.17 20.64,48.9 20,48.26 20,45.72 20.64,45.09 31.75,45.09 36.2,40.64 v69.53,40.64
  Bottom 0.61: U1.25 v69.53,64.14
A11_CPU
  Bottom 0.406: U$5.18 29.53,51.44 30.8,52.7 30.8,57.78 IC2.40
A12  (via drill 0.6 pad 1.42)
  Top 0.406: v119.06,53.98 v119.06,50.16 | v70.8,55.24 v70.8,39.37
  Bottom 0.406: v70.8,55.24 75.56,55.24 76.83,53.98 U1.4 91.44,53.98 92.71,55.24 95.89,55.24 97.16,53.98 IC4.4 v119.06,53.98 | v119.06,50.16 121.92,50.16 134.62,62.87 SV2.27 | U$5.10 19.05,43.81 20.32,42.55 33.02,42.55 36.2,39.37 v70.8,39.37
A12_CPU
  Bottom 0.406: IC2.37 28.26,66.67 26.99,65.41 16.51,65.41 15.88,64.77 15.88,61.91 14.29,60.33 14.29,53.02 9.84,48.58 9.84,47.31 8.89,46.35 U$5.9
A13  (via drill 0.6 pad 1.42)
  Top 0.406: v120.97,53.98 v120.97,48.9 | v55.56,62.87 v55.56,57.78
  Bottom 0.406: v120.97,48.9 121.92,48.9 134.62,61.59 136.84,61.59 138.11,62.87 SV2.28 | v120.97,53.98 119.7,55.24 97.16,55.24 95.89,56.52 IC4.28 92.71,56.52 91.44,55.24 76.83,55.24 75.56,56.52 U1.28 66.99,56.52 65.72,57.78 v55.56,57.78 | U$5.21 24.45,59.05 28.26,62.87 v55.56,62.87
A13_CPU
  Bottom 0.406: IC2.38 28.26,64.14 25.72,61.59 U$5.22
A14  (via drill 0.6 pad 1.42)
  Top 0.406: v33.02,53.98 v29.53,53.98
  Bottom 0.406: U$5.19 v29.53,53.98 | v33.02,53.98 46.35,53.98 47.62,52.7 75.56,52.7 76.83,51.44 U1.3 91.44,51.44 93.98,53.98 IC4.29 95.89,53.98 97.16,52.7 114.3,52.7 119.38,47.62 121.92,47.62 134.62,60.33 SV2.29 136.84,60.33 138.11,61.59 139.7,61.59 140.34,62.23 IC11.2
A14_CPU
  Bottom 0.406: IC2.39 28.26,61.59 23.18,56.52 U$5.20
A15  (via drill 0.6 pad 1.42)
  Top 0.406: v72.07,38.1 v72.07,48.9 | v104.78,46.35 v104.78,51.44
  Bottom 0.406: SV2.30 137.48,59.05 134.62,59.05 122.24,46.67 119.06,46.67 114.3,51.44 IC4.3 v104.78,51.44 | U$5.8 5.4,48.9 4.76,48.26 4.76,43.18 5.4,42.55 18.41,42.55 20.95,40.01 34.29,40.01 36.2,38.1 v72.07,38.1 | v104.78,46.35 97.16,46.35 95.89,47.62 93.34,47.62 90.81,45.09 88.27,45.09 84.45,48.9 U1.31 v72.07,48.9 | SV2.30 | IC11.1 141.28,61.27 140.34,60.33 SV2.30
A15_CPU
  Bottom 0.406: IC2.36 16.83,69.22 14.92,67.31 14.92,62.23 13.34,60.64 13.34,53.34 11.43,51.44 U$5.7
A16  (via drill 0.6 pad 1.42)
  Top 0.406: v106.05,88.58 v106.05,48.9
  Bottom 0.406: U1.2 91.44,48.9 92.71,50.16 95.89,50.16 97.16,48.9 v106.05,48.9 IC4.2 | IC5.4 104.78,100.97 106.05,99.69 v106.05,88.58
A16_A
  Bottom 0.406: IC6.2 99.69,92.08 100.97,93.34 100.97,99.69 99.69,100.97 IC5.2
A16_B  (via drill 0.6 pad 1.42)
  Top 0.406: v103.5,94.61 v117.47,94.61
  Bottom 0.406: IC5.3 102.23,100.97 103.5,99.69 v103.5,94.61 | v117.47,94.61 IC6.12
A17  (via drill 0.6 pad 1.42)
  Top 0.406: v113.67,84.77 v113.67,50.16
  Bottom 0.406: U1.30 75.56,51.44 76.83,50.16 91.44,50.16 92.71,51.44 IC4.30 95.89,51.44 97.16,50.16 v113.67,50.16 | IC5.7 112.39,100.97 113.67,99.69 v113.67,84.77
A17_A
  Bottom 0.406: IC6.5 107.31,92.08 108.58,93.34 108.58,99.69 107.31,100.97 IC5.5
A17_B
  Bottom 0.406: IC6.15 IC5.6
A18  (via drill 0.6 pad 1.42)
  Top 0.406: v114.94,47.62 114.94,76.83 117.47,79.38 v117.47,86.04
  Bottom 0.406: U1.1 90.81,46.35 93.34,48.9 IC4.31 95.89,48.9 97.16,47.62 v114.94,47.62 | IC5.9 114.94,108.58 118.75,104.78 118.75,89.53 117.47,88.27 v117.47,86.04
A18_A
  Bottom 0.406: IC6.6 109.86,92.08 111.12,93.34 111.12,104.14 109.86,105.41 IC5.11
A18_B
  Bottom 0.406: IC6.16 107.31,99.69 106.05,100.97 106.05,103.5 108.58,106.05 108.58,111.44 109.22,112.08 111.76,112.08 112.39,111.44 IC5.10
A19_A  (via drill 0.6 pad 1.42)
  Top 0.406: v102.23,106.36 v111.12,106.36
  Bottom 0.406: IC6.9 117.47,92.08 116.2,93.34 116.2,99.69 115.57,100.33 114.3,100.33 113.67,100.97 113.67,103.82 v111.12,106.36 | IC5.14 v102.23,106.36
A19_B
  Bottom 0.406: IC6.19 99.69,99.69 98.42,100.97 98.42,103.5 99.06,104.14 103.19,104.14 104.78,105.73 IC5.13
A19_CS_EPROM  (via drill 0.6 pad 1.42)
  Top 0.406: v123.19,70.48 v123.19,99.69 | v99.69,10.79 v99.69,70.48
  Bottom 0.406: IC4.22 95.89,71.75 97.16,70.48 v99.69,70.48 v123.19,70.48 | IC5.12 107.31,111.44 108.9,113.03 114.62,113.03 123.19,104.46 v123.19,99.69 | IC7.11 87.63,10.16 89.85,7.94 96.84,7.94 v99.69,10.79
  Bottom 0.61: IC7.12 IC7.11
AEN  (via drill 0.6 pad 1.42)
  Top 0.406: v51.75,66.67 v51.75,80.64 | v25.08,71.75 v25.08,80.64 | v9.53,66.67 v9.53,32.38 | v108.58,10.79 v108.58,17.78
  Bottom 0.406: v51.75,80.64 34.29,80.64 32.07,78.42 32.07,73.66 31.43,73.03 27.94,73.03 26.67,71.75 v25.08,71.75 U$6.1 | v25.08,80.64 20.64,80.64 18.1,78.11 5.4,78.11 4.76,77.47 4.76,67.31 5.4,66.67 U$5.1 | SV2.42 137.48,43.81 134.62,43.81 v108.58,17.78 85.72,17.78 82.87,20.64 54.61,20.64 49.53,25.72 37.47,25.72 33.34,29.84 12.06,29.84 v9.53,32.38 | IC9.4 123.51,8.26 120.97,10.79 v108.58,10.79
  Bottom 0.61: IC3.22 v51.75,66.67 | U$5.1 v9.53,66.67
CLK  (via drill 0.6 pad 1.42)
  Top 0.406: v82.55,102.87 v82.55,25.4
  Bottom 0.406: SV2.36 137.48,51.44 134.62,51.44 108.58,25.4 v82.55,25.4
  Bottom 0.61: IC1.6 v82.55,102.87
CS_0
  Bottom 0.406: SV2.57 126.68,24.77 118.43,16.51 IC9.15
CS_1
  Bottom 0.406: SV2.58 137.48,23.5 127.95,23.5 120.97,16.51 IC9.14
CS_2
  Bottom 0.406: SV2.59 129.22,22.23 123.51,16.51 IC9.13
CS_3
  Bottom 0.406: SV2.60 137.48,20.95 130.49,20.95 126.05,16.51 IC9.12
CS_4
  Bottom 0.406: SV2.61 131.76,19.68 128.59,16.51 IC9.11
CS_5
  Bottom 0.406: SV2.62 137.48,18.41 133.03,18.41 131.13,16.51 IC9.10
CS_6
  Bottom 0.406: IC9.9 133.67,15.88 134.94,17.14 SV2.63
CS_PORT_OUT  (via drill 0.6 pad 1.42)
  Top 0.406: v128.59,12.06 v113.35,12.06
  Bottom 0.406: IC9.7 131.13,9.53 v128.59,12.06 | v113.35,12.06 98.42,12.06 97.16,10.79 IC7.8
CS_RAM1  (via drill 0.6 pad 1.42)
  Top 0.406: v87.63,70.48 v87.63,13.34
  Bottom 0.406: U1.22 75.56,71.75 76.83,70.48 v87.63,70.48 | v87.63,13.34 83.82,13.34 82.55,12.06 IC7.13
D0  (via drill 0.6 pad 1.42)
  Top 0.406: v102.23,87.31 v102.23,76.83 | v127,76.83 v127,84.45 | v69.53,78.11 v69.53,81.92
  Bottom 0.406: v69.53,78.11 75.56,78.11 76.83,76.83 U1.13 91.44,76.83 92.71,78.11 95.89,78.11 97.16,76.83 v102.23,76.83 IC4.13 v127,76.83 | SV2.7 130.18,88.27 v127,84.45 | v69.53,81.92 IC3.13 | v102.23,87.31 IC6.3
D1  (via drill 0.6 pad 1.42)
  Top 0.406: v104.78,87.31 v104.78,79.38 | v129.22,79.38 v129.22,84.45
  Bottom 0.406: SV2.8 137.48,87 131.76,87 v129.22,84.45 | IC3.16 52.39,81.92 53.66,80.64 75.56,80.64 76.83,79.38 U1.14 91.44,79.38 92.71,80.64 95.89,80.64 97.16,79.38 v104.78,79.38 IC4.14 v129.22,79.38 | v104.78,87.31 IC6.4
D2  (via drill 0.6 pad 1.42)
  Top 0.406: v112.39,86.04 v112.39,81.92 | v131.44,81.92 v131.44,84.45 | v61.91,83.19 v61.91,76.83
  Bottom 0.406: SV2.9 132.72,85.72 v131.44,84.45 | v61.91,83.19 75.56,83.19 76.83,81.92 U1.15 91.44,81.92 92.71,83.19 95.89,83.19 97.16,81.92 IC4.15 v112.39,81.92 v131.44,81.92 | v112.39,86.04 IC6.7
  Bottom 0.61: v61.91,76.83 IC3.11
D3  (via drill 0.6 pad 1.42)
  Top 0.406: v68.26,84.45 v68.26,71.75
  Bottom 0.406: 114.94,83.19 97.16,83.19 95.89,84.45 IC4.17 92.71,84.45 91.44,83.19 76.83,83.19 75.56,84.45 U1.17 v68.26,84.45 | 114.94,83.19 132.72,83.19 133.99,84.45 137.48,84.45 SV2.10 | 114.94,83.19 IC6.8
  Bottom 0.61: v68.26,71.75 IC3.9
D4  (via drill 0.6 pad 1.42)
  Top 0.406: v116.2,84.77 v116.2,80.64 | v71.44,81.92 v71.44,61.59
  Bottom 0.406: U1.18 75.56,81.92 76.83,80.64 91.44,80.64 92.71,81.92 IC4.18 95.89,81.92 97.16,80.64 v116.2,80.64 132.08,80.64 134.62,83.19 SV2.11 | v71.44,61.59 IC3.5 | v116.2,84.77 116.2,92.08 114.94,93.34 IC6.13
  Bottom 0.61: U1.18 v71.44,81.92
D5  (via drill 0.6 pad 1.42)
  Top 0.406: v107.31,87.31 v107.31,78.11
  Bottom 0.406: SV2.12 137.48,81.92 134.62,81.92 130.81,78.11 v107.31,78.11 97.16,78.11 95.89,79.38 IC4.19 92.71,79.38 91.44,78.11 76.83,78.11 75.56,79.38 U1.19 66.99,79.38 65.72,78.11 52.39,78.11 51.12,76.83 IC3.18 | IC6.14 112.39,93.34 111.12,92.08 111.12,89.22 109.22,87.31 v107.31,87.31
D6  (via drill 0.6 pad 1.42)
  Top 0.406: v103.5,88.58 v103.5,75.56
  Bottom 0.406: SV2.13 134.62,80.64 129.54,75.56 v103.5,75.56 97.16,75.56 95.89,76.83 IC4.20 92.71,76.83 91.44,75.56 76.83,75.56 75.56,76.83 U1.20 67.31,76.83 66.04,75.56 57.47,75.56 53.66,71.75 IC3.20 | v103.5,88.58 103.5,92.08 104.78,93.34 IC6.17
D7  (via drill 0.6 pad 1.42)
  Top 0.406: v100.97,88.58 v100.97,73.03 | v70.17,66.67 v70.17,74.3
  Bottom 0.406: U1.21 75.56,74.3 76.83,73.03 91.44,73.03 92.71,74.3 IC4.21 95.89,74.3 97.16,73.03 v100.97,73.03 128.27,73.03 134.62,79.38 137.48,79.38 SV2.14 | v100.97,88.58 100.97,92.08 102.23,93.34 IC6.18
  Bottom 0.61: U1.21 v70.17,74.3 | v70.17,66.67 IC3.7
DA0
  Bottom 0.406: IC2.10 46.35,81.92 46.99,82.55 46.99,83.82 47.62,84.45 IC3.15
DA1
  Bottom 0.406: IC2.9 IC3.17
DA2
  Bottom 0.406: IC2.8 46.67,76.83 47.94,78.11 51.12,78.11 52.39,79.38 IC3.12
DA3  (via drill 0.6 pad 1.42)
  Top 0.406: v58.1,76.83 v58.1,74.3
  Bottom 0.406: IC2.7 46.67,74.3 47.94,75.56 51.12,75.56 52.39,76.83 v58.1,76.83
  Bottom 0.61: v58.1,74.3 IC3.10
DA4  (via drill 0.6 pad 1.42)
  Top 0.406: v58.1,65.41 v58.1,62.87
  Bottom 0.406: IC2.3 46.67,64.14 47.94,65.41 v58.1,65.41 | IC3.6 60.33,64.14 59.05,62.87 v58.1,62.87
DA5
  Bottom 0.406: IC2.4 43.18,66.67 42.55,67.31 42.55,72.39 43.18,73.03 46.67,73.03 47.94,74.3 IC3.19
DA6
  Bottom 0.406: IC2.5 IC3.21
DA7
  Bottom 0.406: IC3.8 51.75,69.22 50.48,70.48 47.94,70.48 46.67,71.75 IC2.6
FI1
  Bottom 0.406: IC2.22 42.23,104.78 43.5,103.5 57.78,103.5 59.05,102.23 75.25,102.23 75.88,102.87 IC1.11
FI2  (via drill 0.6 pad 1.42)
  Top 0.406: v62.87,104.46 v62.87,94.61
  Bottom 0.406: v62.87,94.61 IC2.15 | IC1.10 75.88,105.41 74.93,104.46 v62.87,104.46
GND  (via drill 0.6 pad 1.42)
  Top 0.61: v12.06,69.53 v12.06,73.98 | v16.19,46.99 v16.19,39.37 | v99.69,107.63 v113.67,107.63 | v65.09,113.67 v65.09,97.16 | v93.03,118.75 v93.03,113.67 | v65.72,18.1 v65.72,45.72 | v42.23,61.59 v42.23,113.67 | v38.42,99.69 v38.42,113.67 | v132.4,93.34 v132.4,106.68 | v99.69,113.67 v99.69,118.75
  pour Bottom (isolate 0.406, no thermals): 0,122.56 0,0 148.27,0 148.27,122.56
HLDA  (via drill 0.6 pad 1.42)
  Top 0.406: v60.64,53.98 v60.64,104.46 | v58.74,53.98 v58.74,22.86
  Bottom 0.406: IC2.21 31.43,107.31 32.7,106.05 57.78,106.05 59.37,104.46 v60.64,104.46 | SV2.38 137.48,48.9 134.62,48.9 108.58,22.86 v58.74,22.86
  Bottom 0.61: IC3.2 v60.64,53.98 v58.74,53.98
HRQ  (via drill 0.6 pad 1.42)
  Top 0.406: v38.1,26.99 v38.1,89.53
  Bottom 0.406: SV2.41 134.62,45.09 108.58,19.05 85.72,19.05 83.19,21.59 54.93,21.59 49.53,26.99 v38.1,26.99
  Bottom 0.61: v38.1,89.53 IC2.13
INT  (via drill 0.6 pad 1.42)
  Top 0.406: v39.37,92.08 v39.37,30.48
  Bottom 0.406: SV2.32 137.48,56.52 134.62,56.52 108.58,30.48 v39.37,30.48
  Bottom 0.61: IC2.14 v39.37,92.08
INTA  (via drill 0.6 pad 1.42)
  Top 0.406: v54.29,64.14 v54.29,29.21
  Bottom 0.406: SV2.33 134.62,55.24 108.58,29.21 v54.29,29.21
  Bottom 0.61: IC3.23 v54.29,64.14
IO_RD  (via drill 0.6 pad 1.42)
  Top 0.406: v51.75,59.05 v51.75,29.21
  Bottom 0.406: SV2.34 137.48,53.98 134.62,53.98 108.58,27.94 53.02,27.94 v51.75,29.21
  Bottom 0.61: IC3.25 v51.75,59.05
IO_WR  (via drill 0.6 pad 1.42)
  Top 0.406: v56.52,53.98 v56.52,26.67 | v92.71,13.34 v92.71,26.67
  Bottom 0.406: SV2.35 134.62,52.7 108.58,26.67 v92.71,26.67 v56.52,26.67
  Bottom 0.61: IC3.27 v56.52,53.98 | IC7.9 v92.71,13.34
N$1  (via drill 0.6 pad 1.42)
  Top 0.406: v59.37,59.05 v59.37,99.69
  Bottom 0.406: IC2.17 v59.37,99.69
  Bottom 0.61: IC3.4 v59.37,59.05
N$2
  Bottom 0.406: IC5.1 97.16,103.5 98.74,105.09 102.87,105.09 103.5,105.73 103.5,111.12 106.36,113.98 114.94,113.98 128.24,100.68 IC11.4
N$5  (via drill 0.6 pad 1.42)
  Top 0.406: v56.83,56.52 v56.83,102.23
  Bottom 0.406: IC3.3 v56.83,56.52 | IC2.18 v56.83,102.23
N$9
  Bottom 0.61: IC1.14 72.26,95.25 Q1.2
N$10
  Bottom 0.61: C17.2 72.26,92.71 Q1.1
N$11
  Bottom 0.61: C17.1 IC1.15
N$12
  Bottom 0.406: IC1.2 R3.1 88.58,93.98 89.21,94.61 D1.A
  Bottom 0.61: D1.A JP1.2 C19.1
N$13
  Bottom 0.406: U$6.14
  Bottom 0.61: U$6.14 U$6.13 16.51,99.69 19.05,97.16 U$6.11 23.5,97.16 25.08,98.74 R5.2
N$15  (via drill 0.6 pad 1.42)
  Top 0.61: v26.04,38.73 v26.04,41.27
  Bottom 0.406: U$5.11 18.41,41.27 20.95,38.73 U$5.13
  Bottom 0.61: U$5.14 v26.04,41.27 | U$5.13 v26.04,38.73 R4.2
N$23  (via drill 0.6 pad 1.27)
  other vias: 5,117.39
N$24  (via drill 0.6 pad 1.27)
  other vias: 143.11,5
N$25  (via drill 0.6 pad 1.27)
  other vias: 143.11,117.39
N$37  (via drill 0.6 pad 1.27)
  other vias: 5,5
NEG_5V  (via drill 0.6 pad 1.42)
  Top 0.61: v51.75,86.68 v51.75,118.75
  Bottom 0.61: IC2.11 45.72,84.45 47.94,86.68 v51.75,86.68
  Bottom 0.813: C8.1 IC2.11
  Bottom 1.27: X1.1 v51.75,118.75 C7.-
PORT_OUT_WR  (via drill 0.6 pad 1.42)
  Top 0.406: v111.76,13.34 111.76,36.83 125.09,50.16 v125.09,93.03
  Bottom 0.406: IC6.11 120.02,95.89 122.87,93.03 v125.09,93.03 | IC7.10 90.17,9.53 90.81,8.89 93.34,8.89 93.98,9.53 93.98,12.06 95.25,13.34 v111.76,13.34
PULLUP_5V
  Bottom 0.406: R9.1 127,11.43 128.59,9.84 IC9.6
RD  (via drill 0.6 pad 1.42)
  Top 0.406: v85.09,65.41 v85.09,21.59
  Bottom 0.406: IC3.24 56.2,61.59 56.83,62.23 56.83,63.5 57.47,64.14 59.05,64.14 60.33,65.41 70.8,65.41 72.07,66.67 U1.24 75.56,66.67 76.83,65.41 v85.09,65.41 91.44,65.41 92.71,66.67 IC4.24 | SV2.39 134.62,47.62 108.58,21.59 v85.09,21.59
RDYIN  (via drill 0.6 pad 1.42)
  Top 0.406: v88.58,95.89 v121.92,95.89
  Bottom 0.406: v121.92,95.89 SV2.1 | IC1.3 87.95,95.25 v88.58,95.89
  Bottom 0.61: IC1.3 R2.1
READY
  Bottom 0.406: IC2.23 42.23,102.23 43.5,100.97 75.25,100.97 75.88,101.6 78.74,101.6 82.55,97.79 IC1.4
RESET  (via drill 0.6 pad 1.42)
  Top 0.406: v40.64,31.75 v40.64,87 | v83.82,31.75 v83.82,5.71
  Bottom 0.406: IC1.1 83.19,90.17 80.96,87.95 47.31,87.95 46.35,87 IC2.12 | SV2.31 134.62,57.78 108.58,31.75 v83.82,31.75 v40.64,31.75
  Bottom 0.61: v40.64,87 IC2.12 | IC7.2 82.55,4.45 v83.82,5.71 85.09,4.45 IC7.3
SSTB  (via drill 0.6 pad 1.42)
  Top 0.406: v66.99,105.73 v66.99,51.44
  Bottom 0.406: IC1.7 80.01,105.41 78.74,106.68 75.88,106.68 74.93,105.73 v66.99,105.73
  Bottom 0.61: v66.99,51.44 IC3.1
SYNC
  Bottom 0.406: IC1.5 82.55,100.33 78.74,104.14 75.88,104.14 74.93,103.19 59.37,103.19 57.78,104.78 IC2.19
VCC  (via drill 0.6 pad 1.42)
  Top 0.61: v81.28,91.44 v81.28,116.2 | v16.19,73.03 v16.19,66.67 | v10.16,111.12 v10.16,71.75 | v46.99,48.9 v46.99,111.12 | v33.66,48.9 v33.66,38.73 | v43.81,15.24 v43.81,48.9
  Bottom 0.406: v81.28,91.44 86.68,91.44 87.11,91.01 R3.2 | C21.1 18.1,66.67 | IC9.16 115.89,13.65 117.16,12.38 121.6,12.38 122.56,11.43 R9.2
  Bottom 0.61: R2.2 v81.28,91.44 80.01,90.17 IC1.16 C18.1 | R3.2 D1.C | v16.19,66.67 18.1,66.67 U$5.24 | v16.19,73.03 14.92,71.75 v10.16,71.75 U$6.24 6.99,69.72 C22.1 | C11.1 44.77,111.12 44.77,110.17 45.09,111.12 | IC11.5 C3.1 132.21,102.23 C10.+
  Bottom 0.813: R4.1 v33.66,38.73 | IC9.16 C13.1 | C9.1 95.33,109.84 C14.1 IC6.20 | C9.1 IC5.16 | C9.1 95.33,116.2
  Bottom 1.016: C16.+ 21.27,110.81 20.95,111.12 | C12.1 IC7.14
  Bottom 1.27: C6.1 v46.99,48.9 v43.81,48.9 v33.66,48.9 | C6.1 IC3.28 | 44.77,111.12 45.09,111.12 v46.99,111.12 76.2,111.12 v81.28,116.2 95.33,116.2 118.11,116.2 124.33,109.98 C10.+ | 44.77,111.12 X1.4 R5.1 20.95,111.12 15.88,111.12 | IC2.20 44.77,111.12 | C6.1 67.62,48.9 70.17,46.35 U1.32 | C1.1 U1.32 | 15.88,111.12 v10.16,111.12 | C23.+ 15.56,110.81 15.88,111.12 | C2.1 IC4.32 | U1.32 84.45,46.35 87,43.81 C2.1 | IC7.14 80.01,15.24 | C2.1 105.41,43.82 107.95,46.35 IC4.1 | 80.01,15.24 IC9.16 | v43.81,15.24 80.01,15.24
WR  (via drill 0.6 pad 1.42)
  Top 0.406: v86.36,52.7 v86.36,20.32
  Bottom 0.406: v86.36,52.7 76.83,52.7 75.56,53.98 U1.29 66.99,53.98 65.72,55.24 55.88,55.24 54.61,56.52 IC3.26 | SV2.40 137.48,46.35 134.62,46.35 108.58,20.32 v86.36,20.32

### Text on the board
Bottom: POLON ULTRA / CPU BOARD / SQ9RZI 2025